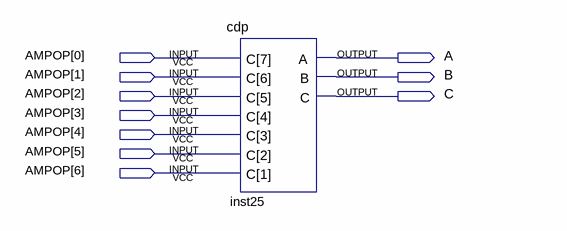
[diagram p0: schematic sheet]
// Quartus schematic pot_abc.bdf as structural Verilog: 1 symbols, 10 pins
module pot_abc (
  input  [6:0] AMPOP,
  output A,
  output B,
  output C
);

  cdp inst25 (.C({AMPOP[0], AMPOP[1], AMPOP[2], AMPOP[3], AMPOP[4], AMPOP[5], AMPOP[6], C}), .A(A), .B(B));
endmodule
